# EAGLE design BaseBoard (EAGLE 6.1)
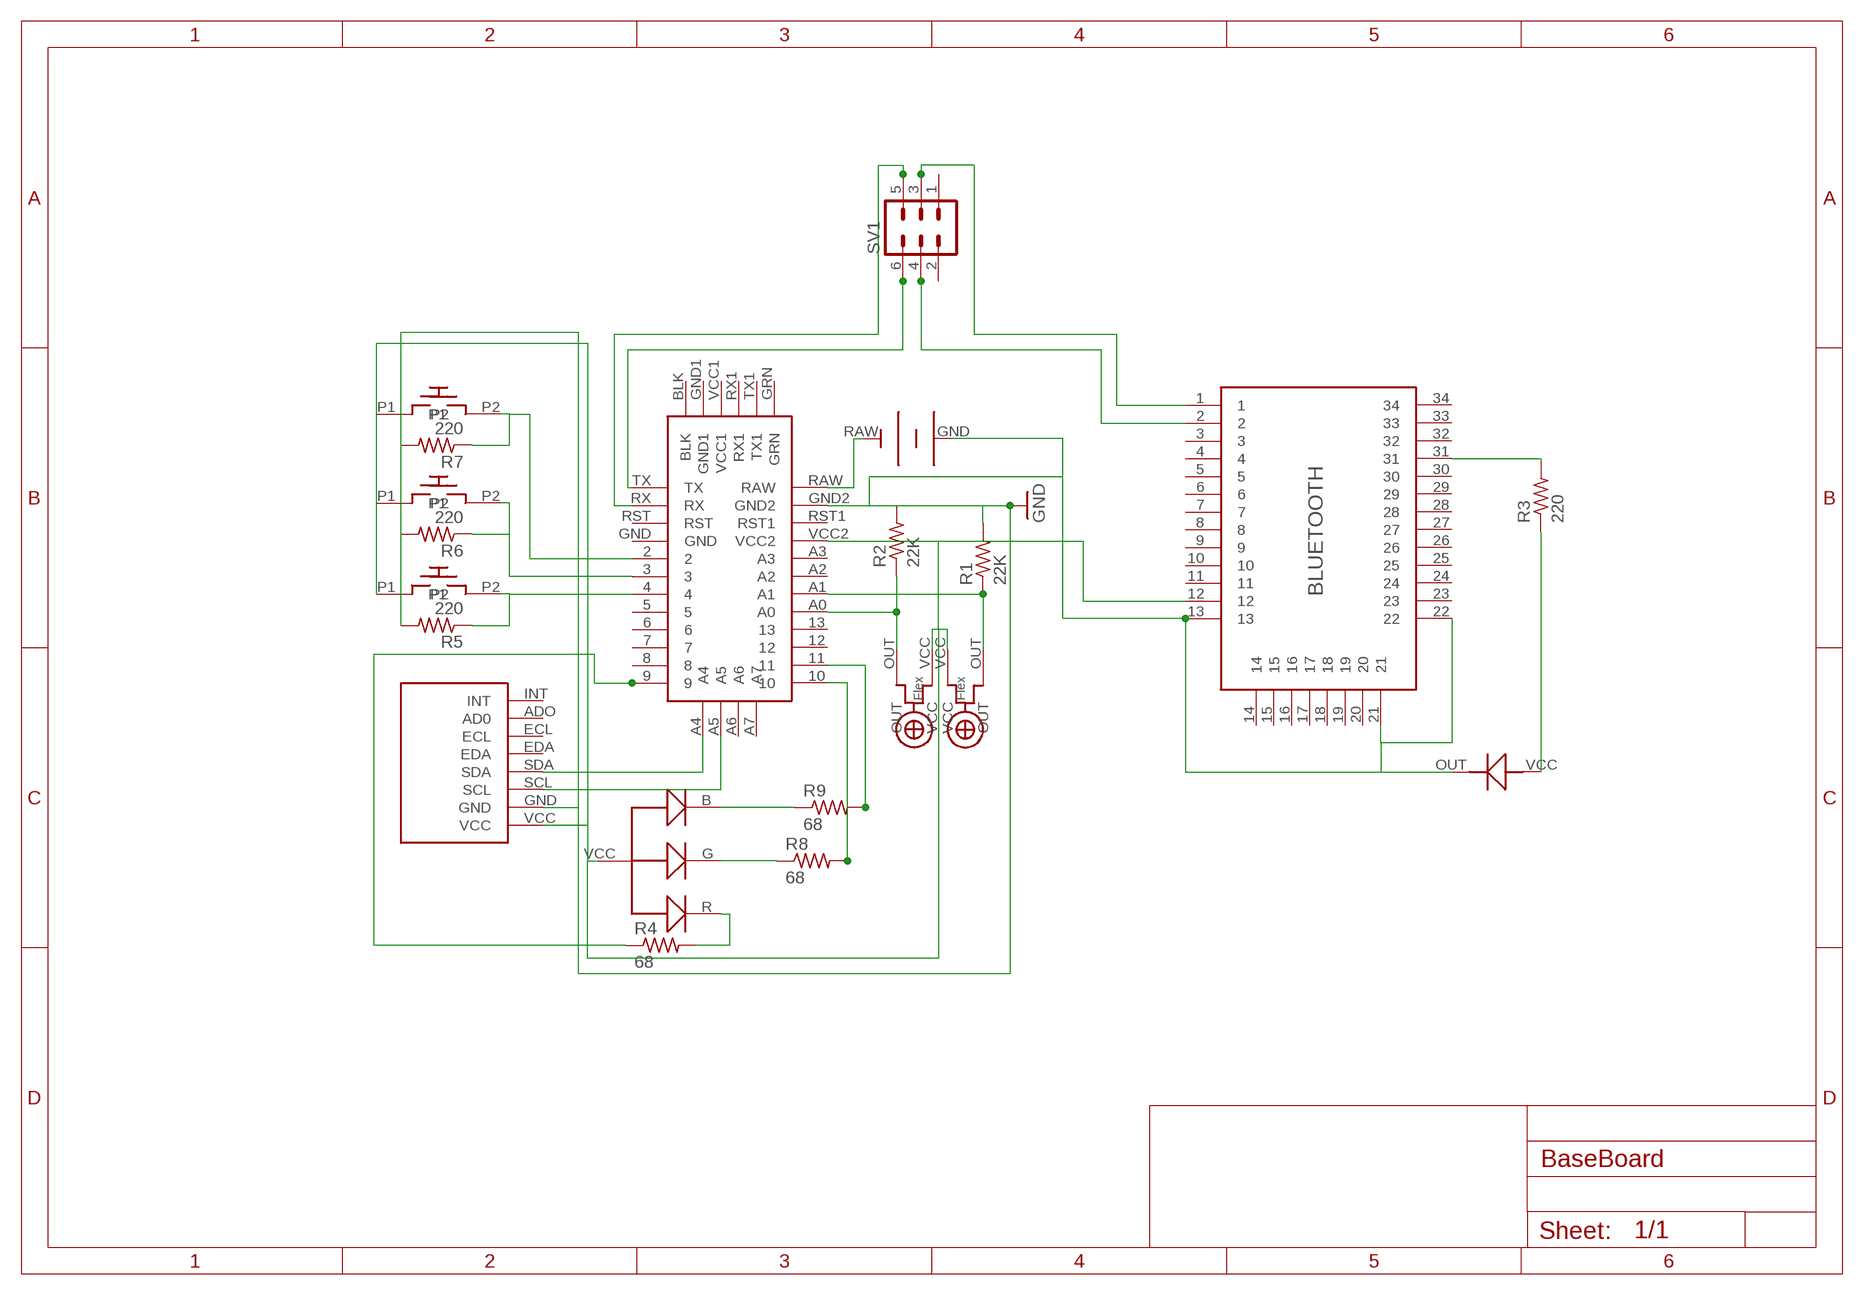
[diagram p0: schematic, sheet 1]

## Parts
BLUETOOTH-LED  LED  [FLEX]
R1  22K  R-US_R1206  [R1206]
R2  22K  R-US_R1206  [R1206]
R3  220  R-US_R1206  [R1206]
R4  68  R-US_R1206  [R1206]
R5  220  R-US_R1206  [R1206]
R6  220  R-US_R1206  [R1206]
R7  220  R-US_R1206  [R1206]
R8  68  R-US_R1206  [R1206]
R9  68  R-US_R1206  [R1206]
SV1  MA03-2  [MA03-2]
TOGGEL  PB  [PB]
U$1  APM  [APM]
U$2  MPU-9150  [MPU-9150]
U$3  FLEX  [FLEX]
U$4  FLEX  [FLEX]
U$5  BATT  [BAT]
U$6  BLUETOOTH  [BLUETOOTH]
U$7  LED-RGB  [LED]
U$9  PB  [PB]
U$10  PB  [PB]

## Nets
GND: BLUETOOTH-LED.OUT R1.2 R2.2 R5.2 R6.2 R7.2 U$1.GND2 U$2.GND U$5.GND U$6.13 U$6.21 U$6.22
N$1: U$1.A4 U$2.SDA
N$2: U$1.A5 U$2.SCL
N$3: R8.1 U$7.G
N$4: R9.1 U$7.B
N$5: TOGGEL.P1 U$1.VCC2 U$2.VCC U$3.VCC U$4.VCC U$6.12 U$7.VCC U$9.P1 U$10.P1
N$6: R2.1 U$1.A0 U$3.OUT
N$7: R1.1 U$1.A1 U$4.OUT
N$8: U$1.RAW U$5.RAW
N$9: R4.2 U$7.R
N$10: R3.2 U$6.31
N$11: BLUETOOTH-LED.VCC R3.1
N$12: SV1.5 U$1.RX
N$13: SV1.6 U$1.TX
N$14: R4.1 U$1.9
N$15: SV1.3 U$6.1
N$16: SV1.4 U$6.2
N$17: R9.2 U$1.11
N$18: R8.2 U$1.10
N$19: R5.1 TOGGEL.P2 U$1.4
N$20: R6.1 U$1.3 U$9.P2
N$21: R7.1 U$1.2 U$10.P2
Unconnected: SV1.1 SV1.2 U$1.5 U$1.6 U$1.7 U$1.8 U$1.12 U$1.13 U$1.A2 U$1.A3 U$1.A6 U$1.A7 U$1.BLK U$1.GND U$1.GND1 U$1.GRN U$1.RST U$1.RST1 U$1.RX1 U$1.TX1 U$1.VCC1 U$2.ADO(AD0) U$2.ECL U$2.EDA U$2.INT U$6.3 U$6.4 U$6.5 U$6.6 U$6.7 U$6.8 U$6.9 U$6.10 U$6.11 U$6.14 U$6.15 U$6.16 U$6.17 U$6.18 U$6.19 U$6.20 U$6.23 U$6.24 U$6.25 U$6.26 U$6.27 U$6.28 U$6.29 U$6.30 U$6.32 U$6.33 U$6.34

## Library data of the parts
BLUETOOTH-LED = BaseBoard:LED
R1-R9 = rcl:R-US_: RESISTOR, American symbol
SV1 = con-lstb:MA03-2: PIN HEADER; OC_FARNELL: unknown; OC_NEWARK: unknown
TOGGEL U$9 U$10 = BaseBoard:PB
U$1 = BaseBoard:APM
U$2 = BaseBoard:MPU-9150
U$3 U$4 = BaseBoard:FLEX
U$5 = BaseBoard:BATT
U$6 = BaseBoard:BLUETOOTH
U$7 = BaseBoard:LED-RGB

## Board
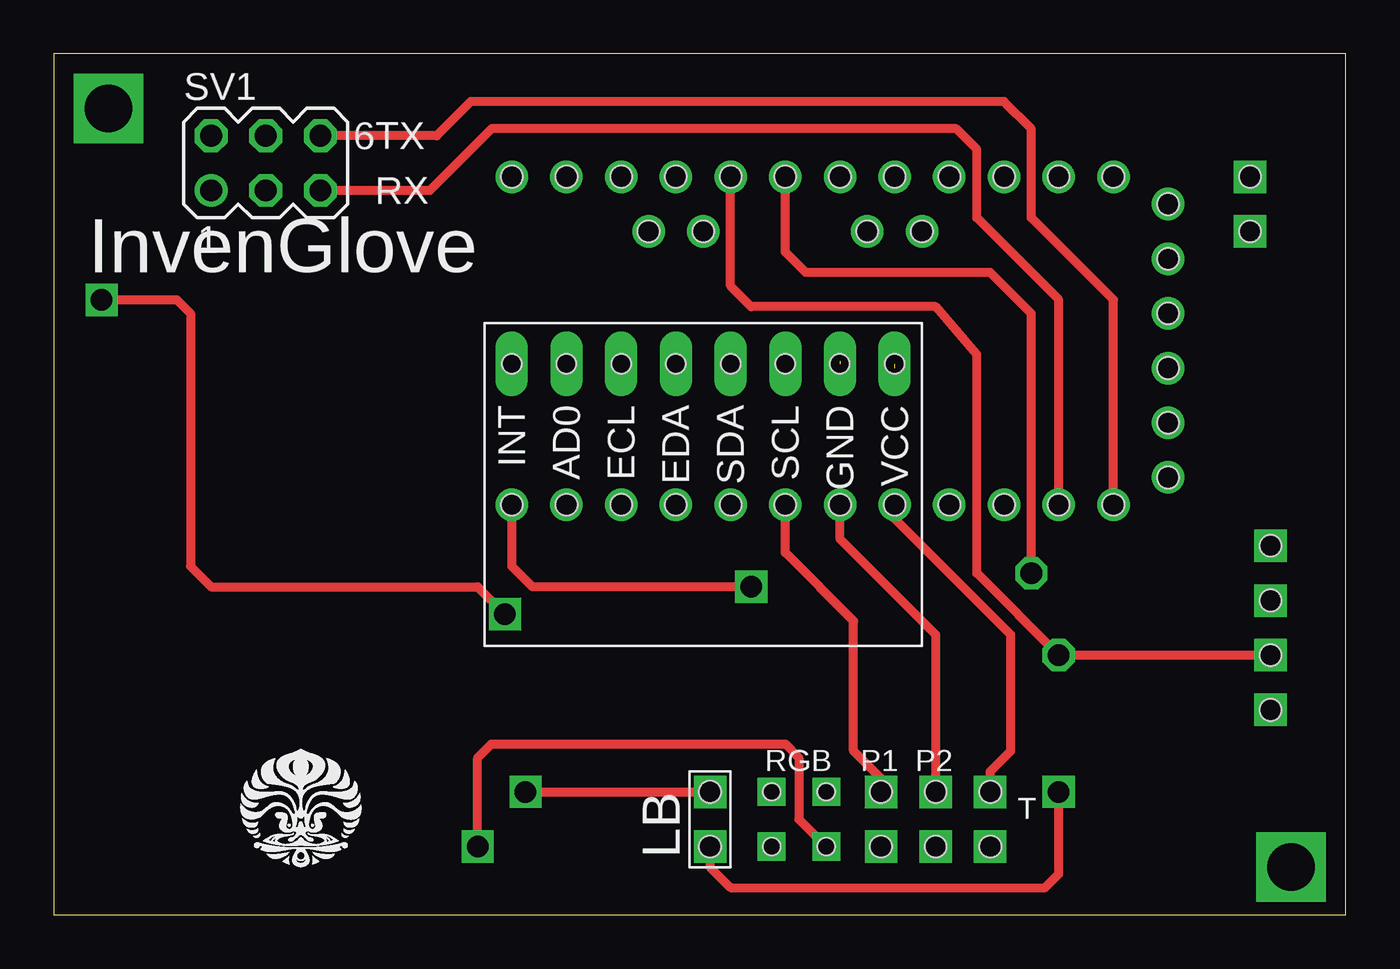
[diagram p1: board, top side]
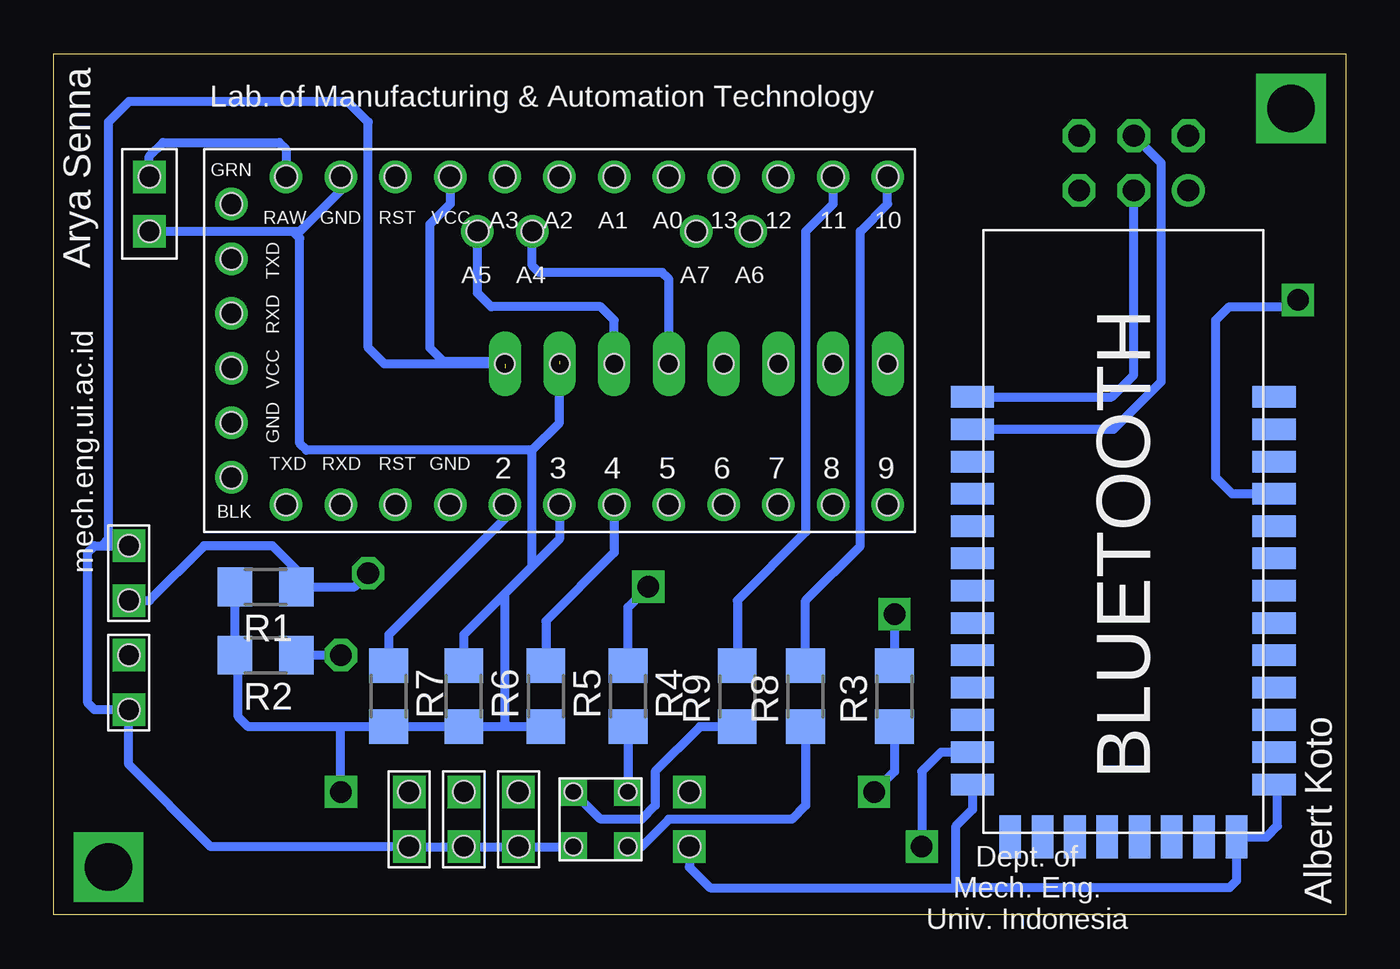
[diagram p2: board, bottom side, seen from below]

Size 60 x 40 mm. Coordinates in mm from the lower left corner, seen from the top.
Outline: 0,0 60,0 60,40 0,40 0,0
Copper layers (1*16): Top 0.035mm / dielectric 1.5mm / Bottom 0.035mm
Design rules: minimum track width 15mil, minimum drill 31mil, track to track 10mil, track to pad 10mil, pad to pad 10mil, via to via 10mil, smd to smd 10mil, copper to edge 40mil, drill to drill 10mil, minimum pad ring 10mil, minimum via ring 8mil, stop-mask expansion 4mil, vias tented up to drill 0mil, thermal gap 10mil

### Footprints (pad centres in the part's own frame; a part is rotated, then mirrored left to right if it is on the bottom)
FLEX = drill 1 square: OUT 1.27,0; VCC -1.27,0 | hole 1: -1.27,0; 1.27,0
R1206 = smd 1.6 x 1.803: 1 -1.422,0; 2 1.422,0
MA03-2 = drill 1.016: 1 -2.54,-1.27 | drill 1.016 octagon: 2 -2.54,1.27; 3 0,-1.27; 4 0,1.27; 5 2.54,-1.27; 6 2.54,1.27
PB = drill 1 square: P1 -1.27,0; P2 1.27,0 | hole 1: -1.27,0; 1.27,0
APM = drill 1: 2 1.27,19.05; 3 1.27,16.51; 4 1.27,13.97; 5 1.27,11.43; 6 1.27,8.89; 7 1.27,6.35; 8 1.27,3.81; 9 1.27,1.27; 10 16.51,1.27; 11 16.51,3.81; 12 16.51,6.35; 13 16.51,8.89; A0 16.51,11.43; A1 16.51,13.97; A2 16.51,16.51; A3 16.51,19.05; A4 13.97,17.78; A5 13.97,20.32; A6 13.97,7.62; A7 13.97,10.16; BLK 2.54,31.75; GND 1.27,21.59; GND1 5.08,31.75; GND2 16.51,26.67; GRN 15.24,31.75; RAW 16.51,29.21; RST 1.27,24.13; RST1 16.51,24.13; RX 1.27,26.67; RX1 10.16,31.75; TX 1.27,29.21; TX1 12.7,31.75; VCC1 7.62,31.75; VCC2 16.51,21.59 | hole 1: 1.27,1.27; 1.27,3.81; 1.27,6.35; 1.27,8.89; 1.27,11.43; 1.27,13.97; 1.27,16.51; 1.27,19.05; 1.27,21.59; 1.27,24.13; 1.27,26.67; 1.27,29.21; 2.54,31.75; 5.08,31.75; 7.62,31.75; 10.16,31.75; 12.7,31.75; 15.24,31.75; 16.51,29.21; 16.51,26.67; 16.51,24.13; 16.51,21.59; 16.51,19.05; 16.51,16.51; 16.51,13.97; 16.51,11.43; 16.51,8.89; 16.51,6.35; 16.51,3.81; 16.51,1.27; 13.97,17.78; 13.97,20.32; 13.97,7.62; 13.97,10.16
MPU-9150 = drill 1 long: ADO 1.905,3.81; ECL 1.905,6.35; EDA 1.905,8.89; GND 1.905,16.51; INT 1.905,1.27; SCL 1.905,13.97; SDA 1.905,11.43; VCC 1.905,19.05 | hole 0.9: 1.905,19.05; 1.905,16.51; 1.905,13.97; 1.905,11.43; 1.905,8.89; 1.905,6.35; 1.905,3.81; 1.905,1.27
BAT = drill 1 square: GND -1.27,0; RAW 1.27,0 | hole 1: -1.27,0; 1.27,0
BLUETOOTH = smd 2 x 1: 1 -0.5,20.25; 2 -0.5,18.75; 3 -0.5,17.25; 4 -0.5,15.75; 5 -0.5,14.25; 6 -0.5,12.75; 7 -0.5,11.25; 8 -0.5,9.75; 9 -0.5,8.25; 10 -0.5,6.75; 11 -0.5,5.25; 12 -0.5,3.75; 13 -0.5,2.25; 22 13.5,2.25; 23 13.5,3.75; 24 13.5,5.25; 25 13.5,6.75; 26 13.5,8.25; 27 13.5,9.75; 28 13.5,11.25; 29 13.5,12.75; 30 13.5,14.25; 31 13.5,15.75; 32 13.5,17.25; 33 13.5,18.75; 34 13.5,20.25 | smd 1 x 2: 14 1.25,-0.182; 15 2.75,-0.182; 16 4.25,-0.182; 17 5.75,-0.182; 18 7.25,-0.182; 19 8.75,-0.182; 20 10.25,-0.182; 21 11.75,-0.182
LED = drill 0.8 square: B 0.635,0.635; G 3.175,3.175; R 0.635,3.175; VCC 3.175,0.635 | hole 0.8: 0.635,3.175; 3.175,3.175; 0.635,0.635; 3.175,0.635

### Placement (x,y rotation side)
BLUETOOTH-LED  30.48,4.45 270 top
R1  50.16,15.24 180 bottom
R2  50.16,12.06 180 bottom
R3  20.95,10.16 90 bottom
R4  33.34,10.16 270 bottom
R5  37.15,10.16 270 bottom
R6  40.96,10.16 270 bottom
R7  44.45,10.16 270 bottom
R8  25.08,10.16 90 bottom
R9  28.26,10.16 90 bottom
SV1  9.84,34.92 0 top
TOGGEL  38.42,4.45 90 bottom
U$1  20,17.78 90 bottom
U$2  20,27.5 270 top
U$3  56.52,10.79 90 bottom
U$4  56.52,15.88 270 bottom
U$5  55.56,33.02 90 bottom
U$6  16.83,3.81 0 bottom
U$7  36.51,6.35 270 bottom
U$8  [MAKARABOTTOM]  14.29,2.22 0 bottom
U$9  40.96,4.45 90 bottom
U$10  43.5,4.45 90 bottom

### Tracks (layer width: path | path; a pad name or v marks a point on that pad's centre or on a via)
GND  (via drill 1)  (1 unrouted)
  Top 0.406: BLUETOOTH-LED.OUT 30.48,2.22 31.43,1.27 46.04,1.27 46.67,1.91 v46.67,5.71
  Bottom 0.406: R1.2 R2.2 51.44,11.91 51.44,9.21 50.97,8.74 46.67,8.74 | BLUETOOTH-LED.OUT 30.48,2.22 29.53,1.27 18.1,1.27 | U$6.13 17.33,4.9 18.1,4.13 18.1,1.27 | U$6.22 3.17,5.91 3.17,4.13 3.67,3.63 U$6.21 5.08,1.59 5.4,1.27 18.1,1.27 | 46.67,8.74 R7.2 R6.2 R5.2 38.9,8.74 39.05,8.89 39.05,14.92 37.78,16.19 37.78,21.59 | U$1.GND2 46.67,33.66 48.58,31.75 48.9,31.75 | 48.9,31.75 U$5.GND | v46.67,5.71 46.67,8.74 | 36.51,25.72 36.51,22.86 37.78,21.59 | 37.78,21.59 48.26,21.59 48.58,21.91 48.58,31.43 48.9,31.75
N$1
  Bottom 0.406: U$2.SDA 31.43,29.52 31.75,29.84 37.47,29.84 37.78,30.16 U$1.A4
N$2
  Bottom 0.406: U$2.SCL 33.97,27.62 34.61,28.26 39.69,28.26 40.32,28.89 U$1.A5
N$3
  Bottom 0.406: R8.1 25.08,5.08 25.72,4.45 31.43,4.45 32.7,3.17 U$7.G
N$4
  Bottom 0.406: R9.1 30,8.74 32.07,6.67 32.07,5.08 32.7,4.45 34.61,4.45 U$7.B
N$5  (via drill 1)  (1 unrouted)
  Top 0.406: v19.68,3.17 19.68,7.3 20.32,7.94 33.97,7.94 34.61,7.3 34.61,4.45 U$7.VCC
  Bottom 0.406: 57.78,17.14 58.1,17.14 58.42,16.83 58.42,9.84 58.1,9.53 U$3.VCC 56.52,6.99 52.7,3.17 U$10.P1 U$9.P1 TOGGEL.P1 U$7.VCC | 57.78,17.14 U$4.VCC | U$1.VCC2 41.59,33.02 42.55,32.07 42.55,26.35 41.91,25.72 39.37,25.72 39.05,25.4 | U$2.VCC 44.65,25.59 45.4,26.35 45.4,36.83 46.35,37.78 56.52,37.78 57.47,36.83 57.47,17.46 57.78,17.14 | U$6.12 18.79,7.56 19.68,6.67 v19.68,3.17
N$6  (via drill 1)
  Top 0.406: U$1.A0 31.43,29.21 32.38,28.26 40.96,28.26 42.86,26.04 42.86,15.88 v46.67,12.06 U$3.OUT
  Bottom 0.406: v46.67,12.06 R2.1
N$7  (via drill 1)
  Top 0.406: v45.4,15.88 45.4,27.94 43.5,29.84 34.92,29.84 33.97,30.8 U$1.A1
  Bottom 0.406: R1.1 48.74,16.04 48.9,16.19 | 48.9,16.19 49.85,17.14 53.02,17.14 55.56,14.61 U$4.OUT | 48.9,16.19 48.9,15.88 48.26,15.24 46.04,15.24 v45.4,15.88
N$8
  Bottom 0.406: U$5.RAW 55.56,35.24 54.93,35.88 49.53,35.88 49.21,35.56 U$1.RAW
N$9
  Bottom 0.406: R4.2 U$7.R
N$10  (via drill 1)
  Top 0.406: v2.22,28.57 5.71,28.57 6.35,27.94 6.35,16.19 7.3,15.24 19.68,15.24 v20.95,13.97
  Bottom 0.406: U$6.31 5.27,19.56 6.03,20.32 6.03,27.62 5.4,28.26 2.54,28.26 v2.22,28.57 | v20.95,13.97 R3.2
N$11  (via drill 1)
  Top 0.406: v21.91,5.71 BLUETOOTH-LED.VCC
  Bottom 0.406: R3.1 20.95,6.67 v21.91,5.71
N$12
  Top 0.406: U$1.RX 46.67,28.57 42.86,32.38 42.86,35.56 41.91,36.51 20.32,36.51 17.46,33.66 SV1.5
N$13
  Top 0.406: U$1.TX 49.21,28.57 45.4,32.38 45.4,36.51 44.13,37.78 19.37,37.78 17.78,36.2 SV1.6
N$14  (via drill 1)
  Top 0.406: v32.38,15.24 22.23,15.24 21.27,16.19 U$1.9
  Bottom 0.406: R4.1 33.34,14.29 v32.38,15.24
N$15
  Bottom 0.406: U$6.1 10.87,24.06 9.84,25.08 SV1.3
N$16
  Bottom 0.406: U$6.2 10.78,22.56 8.57,24.77 8.57,34.92 SV1.4
N$17
  Bottom 0.406: U$1.11 23.81,33.02 25.08,31.75 25.08,17.78 28.26,14.61 R9.2
N$18
  Bottom 0.406: R8.2 25.08,14.61 22.54,17.14 22.54,31.75 21.27,33.02 U$1.10
N$19
  Top 0.406: TOGGEL.P2 38.42,6.35 37.15,7.62 37.15,13.65 33.97,16.83 U$1.4
  Bottom 0.406: U$1.4 33.97,16.83 37.15,13.65 R5.1
N$20
  Top 0.406: U$9.P2 40.96,13.02 36.51,17.46 U$1.3
  Bottom 0.406: U$1.3 36.51,17.46 40.96,13.02 R6.1
N$21
  Top 0.406: U$10.P2 43.5,6.67 44.45,7.62 44.45,13.02 39.05,18.41 U$1.2
  Bottom 0.406: U$1.2 39.05,18.41 44.45,13.02 R7.1
N$22  (via drill 2.2)
  other vias: 2.54,37.47
N$23  (via drill 2.2)
  other vias: 57.47,2.22

### Text on the board
tPlace: InvenGlove
bPlace: Lab. of Manufacturing & Automation Technology | Arya Senna | mech.eng.ui.ac.id | Albert Koto | Dept. of / Mech. Eng. / Univ. Indonesia
tNames: TX | RX | RGB | P1 | P2 | LB | T